# Altium project Elec391Prj.PrjPcb
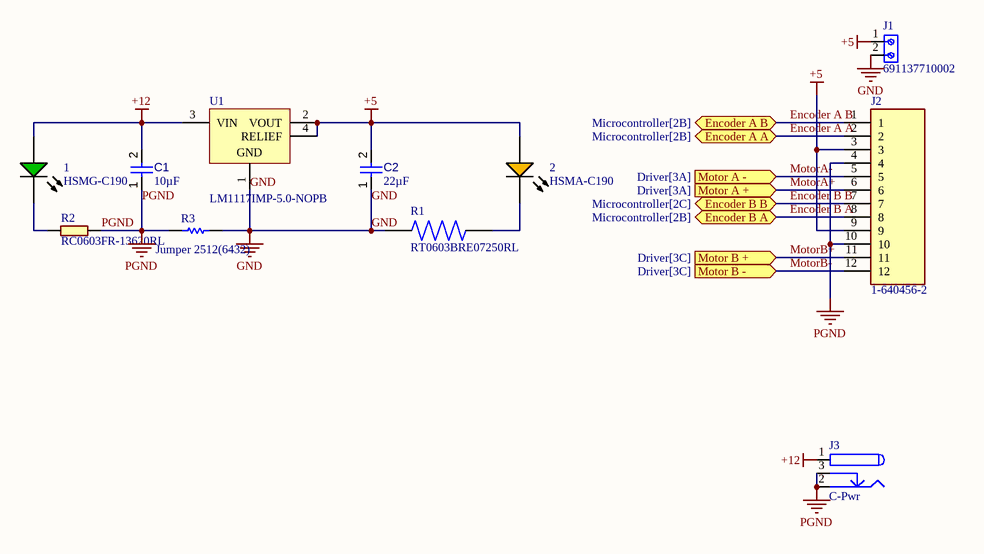
[diagram p0: IO.SchDoc]
3 sheets, 30 parts. Net scope: flat (ports and power ports of the same name join across sheets).
Board file: PCB.PcbDoc
Sheets:
  IO.SchDoc
  Microcontroller.SchDoc
  Driver.SchDoc

## Sheet IO.SchDoc
size A4; SheetNumber: 1; SheetTotal: 3

### Parts
1  HSMG-C190  [AVAG-HSMX-C190_V]
2  HSMA-C190  [AVAG-HSMX-C190_V]
C1  value 10µF  [CAPC0603(1608)100_L]  (hidden comment: Capacitor 10µF +/-20% 10V 0603)
C2  value 22µF  [CAPC0805(2012)145_L]  (hidden comment: Capacitor 22µF +/-40% 16V 0805)
J1  691137710002  [691137710002]
J2  1-640456-2  [TE_1-640456-2]
J3  C-Pwr  [KLD_XLGE1.2]
R1  RT0603BRE07250RL  [RESC1608X55N]
R2  RC0603FR-13620RL  [0603]
R3  Jumper 2512(6432)  [RESC2512(6432)_L]
U1  LM1117IMP-5.0-NOPB  [DCY0004A_M]

### Ports
Encoder A A (bidir, see Microcontroller[2B]), Encoder A B (bidir, see Microcontroller[2B]), Encoder B A (bidir, see Microcontroller[2B]), Encoder B B (bidir, see Microcontroller[2C]), Motor A + (in, see Driver[3A]), Motor A - (in, see Driver[3A]), Motor B + (in, see Driver[3C]), Motor B - (in, see Driver[3C])

### Nets
+5: 2.1(A) C2.2 J1.1 J2.3 J2.9 U1.2(VOUT) U1.4(RELIEF)
+12: 1.1(A) C1.2 J3.1 U1.3(VIN)
GND: C2.1 J1.2 R1.1 R3.2 U1.1(GND)
PGND: C1.1 J2.4 J2.10 J3.2 J3.3 R2.2 R3.1
Encoder A A: J2.2 ; port Encoder A A
Encoder A B: J2.1 ; port Encoder A B
Encoder B A: J2.8 ; port Encoder B A
Encoder B B: J2.7 ; port Encoder B B
MotorA+: J2.6 ; port Motor A +
MotorA-: J2.5 ; port Motor A -
MotorB+: J2.11 ; port Motor B +
MotorB-: J2.12 ; port Motor B -
Net1_2: 1.2(K) R2.1
Net2_2: 2.2(K) R1.2

### Library data of the parts
1 = CMP-007-00013-2: LED Uni-Color Green, 52 mW, 20 mA, -40 to 85 degC, 2-Pin SMD, RoHS, Tape and Reel; Manufacturer: Avago; Forward Current: 20mA; Viewing Angle: 170degrees; Luminous Intensity: 15mcd; Lens Style: Diffused; Forward Voltage: 2.2V; Power: 52mW; Mounting Technology: SM; RoHS Compliant: True; Packaging: TapeandReel; Illumination Colour: Green; Datasheet URL: http://docs.avagotech.com/docs/AV02-0551EN; Min Operating Temperature: -40°C; Max Operating Temperature: 85°C; Pins: 2; Package Description: 2-Pin Surface Mount Device, Body 1.6 x 0.8 mm, Height 0.9 mm; Nominal Vf: 2.2V; Case/Package: 0603; Manufacturer URL: http://www.avagotech.com/; Datasheet Version: Mar-12; Colour: Green; Package Reference: HSMX-C190; Package Quantity: 4000
2 = CMP-007-00011-2: LED Uni-Color Amber, 60 mW, 20 mA, -40 to 85 degC, 2-Pin SMD, RoHS, Tape and Reel; Manufacturer: Avago; Forward Current: 20mA; Luminous Intensity: 90mcd; Lens Style: Diffused; Power: 60mW; Nominal Vf: 1.9V; Viewing Angle: 170degrees; Illumination Colour: Orange; Datasheet Version: Sep-10; Mounting Technology: SM; Case/Package: 0603; RoHS Compliant: True; Pins: 2; Packaging: TapeandReel; Colour: Orange; Package Reference: HSMX-C190; Manufacturer URL: http://www.avagotech.com/; Package Quantity: 4000; Min Operating Temperature: -40°C; Datasheet URL: http://docs.avagotech.com/docs/AV02-0112EN; Max Operating Temperature: 85°C; Forward Voltage: 1.9V; Package Description: 2-Pin Surface Mount Device, Body 1.6 x 0.8 mm, Height 0.9 mm
C1 = CMP-001-00075-4: Chip Capacitor, 10µF +/-20%, 10V, 0603, Thickness 1 mm; Tolerance: 10%; Voltage Rating: 10V; Max Operating Temperature: 85°C; Pins: 2; Case/Package: 0603; Mounting Technology: SMT; Min Operating Temperature: -55°C
C2 = CMP-001-00081-4: Chip Capacitor, 22µF +/-40%, 16V, 0805, Thickness 1.45 mm; Tolerance: 5%; Voltage Rating: 16V; Mounting Technology: SMT; Pins: 2; Max Operating Temperature: 85°C; Case/Package: 0805; Min Operating Temperature: -55°C
J1 = 691137710002: 2 Position Wire to Board Terminal Block Horizontal with Board 0.197 (5.00mm) Through Hole; MF: WÃ¼rth Elektronik; Price: None; Check_prices: https://www.snapeda.com/parts/691137710002/W%C3%BCrth%20Elektronik/view-part/4793356/?ref=eda; MP: 691137710002; SnapEDA_Link: https://www.snapeda.com/parts/691137710002/W%C3%BCrth%20Elektronik/view-part/4793356/?ref=snap; Package: None; Availability: Warning; Value: *; Purchase-URL: https://pricing.snapeda.com/search/part/691137710002/?ref=eda
J3 = C-Pwr: Low Voltage Power Supply Connector; Published: 17-Dec-2003; DatasheetDocument: 09-May-2002; Publisher: Altium Limited; ComponentLink1Description: Manufacturer Link; ComponentLink1URL: http://domino.kycon.com/internet/Products.html; ComponentLink2URL: http://www.cui.com/product/resource/pj-102a.pdf; ComponentLink2Description: Datasheet (ELEC391)
R1 = RT0603BRE07250RL: 250 Ohms Â±0.1% 0.1W, 1/10W Chip Resistor 0603 (1608 Metric) - Thin Film; MF: Yageo; Value: *; SnapEDA_Link: https://www.snapeda.com/parts/RT0603BRE07250RL/Yageo/view-part/?ref=snap; Purchase-URL: https://pricing.snapeda.com/search/part/RT0603BRE07250RL/?ref=eda; Availability: In Stock; Price: None; Package: 1608 Yageo; Check_prices: https://www.snapeda.com/parts/RT0603BRE07250RL/Yageo/view-part/?ref=eda; MP: RT0603BRE07250RL
R2 = RC0603FR-13620RL: https://octopart.com/rc0603fr-13100kl-yageo-12819546; Package: None; Price: None; Value: *; MP: RC0603FR-13620RL; Availability: Unavailable
R3 = CMP-1018-00001-1: Jumper 2512 (6432 Metric); Tolerance: None; Case-EIA: 2512; Value: 0.00 Ohm; Case-Metric: 6432; Technology: SMT; Power: None
U1 = CMP-019-00021-4: Low-Dropout Linear Regulator, 800 mA, -40 to 125 degC, 4-Pin SOT-223 (DCY), Green (RoHS & no Sb/Br), Tape and Reel; Manufacturer: Texas Instruments; Nominal Output Voltage: 5V; Dropout Voltage: 1.2V; Output Current: 800mA; Min Input Voltage: 2.6V; Max Input Voltage: 15V; Outputs: 1; Datasheet Version: SNOS412N, 01/2016; Case/Package: SOT-223; Min Operating Temperature: -40°C; Mounting Technology: SM; Package Description: 4-Pin Small Outline Transistor, Body 6.5 x 3.5 mm, Pitch 2.3 mm; Max Ouput Current: 800mA; Output Voltage: 5V; Manufacturer URL: http://www.ti.com/; Max Operating Temperature: 125°C; Datasheet URL: http://www.ti.com/lit/ds/symlink/lm1117.pdf; Packaging: TapeandReel; RoHS Compliant: True; Package Reference: DCY0004A; Pins: 4
J2 = 1-640456-2: Package: None; Price: None; Value: *; MP: 1-640456-2; Availability: Unavailable

## Sheet Microcontroller.SchDoc
size A4; SheetNumber: 2; SheetTotal: 3
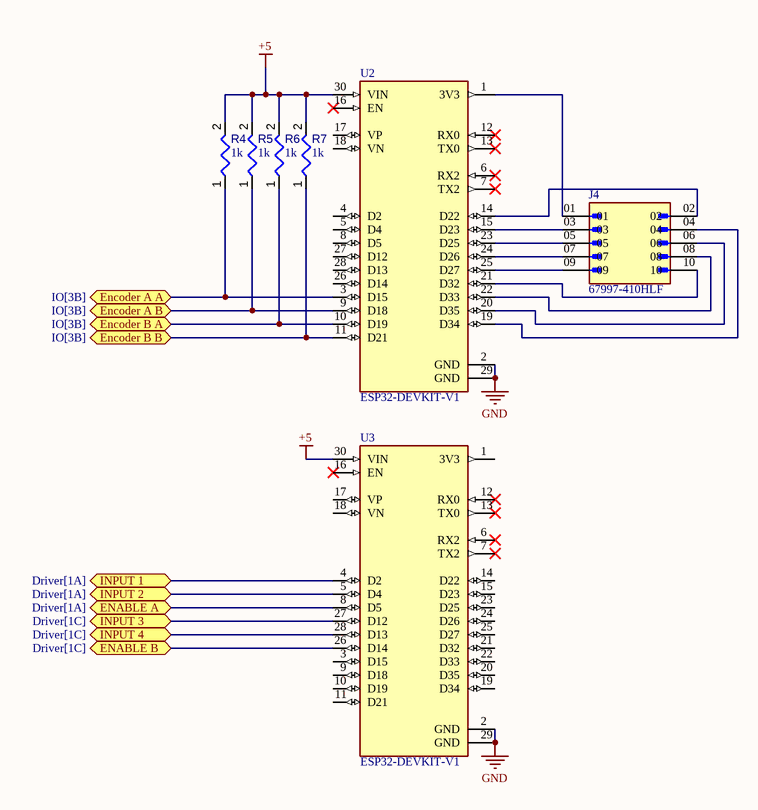
[diagram p1: Microcontroller.SchDoc]

### Parts
J4  67997-410HLF  [AMPHENOL_67997-410HLF]
R4  value 1k  [RESC1608X55X25ML10T15]  (hidden comment: Resistor 1k +/-1% 0603 100 mW)
R5  value 1k  [RESC1608X55X25ML10T15]  (hidden comment: Resistor 1k +/-1% 0603 100 mW)
R6  value 1k  [RESC1608X55X25ML10T15]  (hidden comment: Resistor 1k +/-1% 0603 100 mW)
R7  value 1k  [RESC1608X55X25ML10T15]  (hidden comment: Resistor 1k +/-1% 0603 100 mW)
U2  ESP32-DEVKIT-V1  [MODULE_ESP32_DEVKIT_V1]
U3  ESP32-DEVKIT-V1  [MODULE_ESP32_DEVKIT_V1]

### Ports
ENABLE A (bidir, see Driver[1A]), ENABLE B (bidir, see Driver[1C]), Encoder A A (bidir, see IO[3B]), Encoder A B (bidir, see IO[3B]), Encoder B A (bidir, see IO[3B]), Encoder B B (bidir, see IO[3B]), INPUT 1 (bidir, see Driver[1A]), INPUT 2 (bidir, see Driver[1A]), INPUT 3 (bidir, see Driver[1C]), INPUT 4 (bidir, see Driver[1C])

### Nets
+5: R4.2 R5.2 R6.2 R7.2 U2.30(VIN) U3.30(VIN)
GND: U2.2(GND) U2.29(GND) U3.2(GND) U3.29(GND)
Encoder A A: R4.1 U2.3(D15) ; port Encoder A A
Encoder A B: R5.1 U2.9(D18) ; port Encoder A B
Encoder B A: R6.1 U2.10(D19) ; port Encoder B A
Encoder B B: R7.1 U2.11(D21) ; port Encoder B B
NetJ4_01: J4.01 U2.1(3V3)
NetJ4_02: J4.02 U2.14(D22)
NetJ4_03: J4.03 U2.15(D23)
NetJ4_04: J4.04 U2.19(D34)
NetJ4_05: J4.05 U2.23(D25)
NetJ4_06: J4.06 U2.20(D35)
NetJ4_07: J4.07 U2.24(D26)
NetJ4_08: J4.08 U2.22(D33)
NetJ4_09: J4.09 U2.25(D27)
NetJ4_10: J4.10 U2.21(D32)
NetU3_4: U3.4(D2) ; port INPUT 1
NetU3_5: U3.5(D4) ; port INPUT 2
NetU3_8: U3.8(D5) ; port ENABLE A
NetU3_26: U3.26(D14) ; port ENABLE B
NetU3_27: U3.27(D12) ; port INPUT 3
NetU3_28: U3.28(D13) ; port INPUT 4

Not connected (* = marked no-connect by the designer): U2 4(D2) 5(D4) 6(RX2)* 7(TX2)* 8(D5) 12(RX0)* 13(TX0)* 16(EN)* 17(VP) 18(VN) 26(D14) 27(D12) 28(D13); U3 1(3V3) 3(D15) 6(RX2)* 7(TX2)* 9(D18) 10(D19) 11(D21) 12(RX0)* 13(TX0)* 14(D22) 15(D23) 16(EN)* 17(VP) 18(VN) 19(D34) 20(D35) 21(D32) 22(D33) 23(D25) 24(D26) 25(D27)

### Library data of the parts
J4 = 67997-410HLF: BergStikÂ®, Board to Board connector, Unshrouded vertical header, Through Hole, Double Row, 10 Positions, 2.54 mm (0.100in) Pitch; MF: Amphenol ICC; Value: *; MP: 67997-410HLF; Package: None; SnapEDA_Link: https://www.snapeda.com/parts/67997-410HLF/Amphenol+FCI/view-part/?ref=snap; Check_prices: https://www.snapeda.com/parts/67997-410HLF/Amphenol+FCI/view-part/?ref=eda; Digi-Key_Part_Number: 609-3243-ND; Purchase-URL: https://pricing.snapeda.com/search/part/67997-410HLF/?ref=eda
R4-R7 = CMP-009-00014-5: Chip Resistor, 1 KOhm, +/-1%, 0.1 W, -55 to 155 degC, 0603 (1608 Metric); Voltage Rating: 50V; Power: 100mW; Tolerance: 1%; Mounting Technology: SM; Pins: 2; Case/Package: 0603; Min Operating Temperature: -55°C; RoHS Compliant: True; Max Operating Temperature: 155°C
U2 U3 = ESP32-DEVKIT-V1: Dual core, Wi-Fi: 2.4 GHz up to 150 Mbits/s,BLE (Bluetooth Low Energy) and legacy Bluetooth, 32 bits, Up to 240 MHz; MF: Do it; Price: None; Availability: Not in stock; Package: None; MP: ESP32-DEVKIT-V1; Value: *; SnapEDA_Link: https://www.snapeda.com/parts/ESP32-DEVKIT-V1/Do+it/view-part/?ref=snap; Check_prices: https://www.snapeda.com/parts/ESP32-DEVKIT-V1/Do+it/view-part/?ref=eda

## Sheet Driver.SchDoc
size A4; SheetNumber: 3; SheetTotal: 3
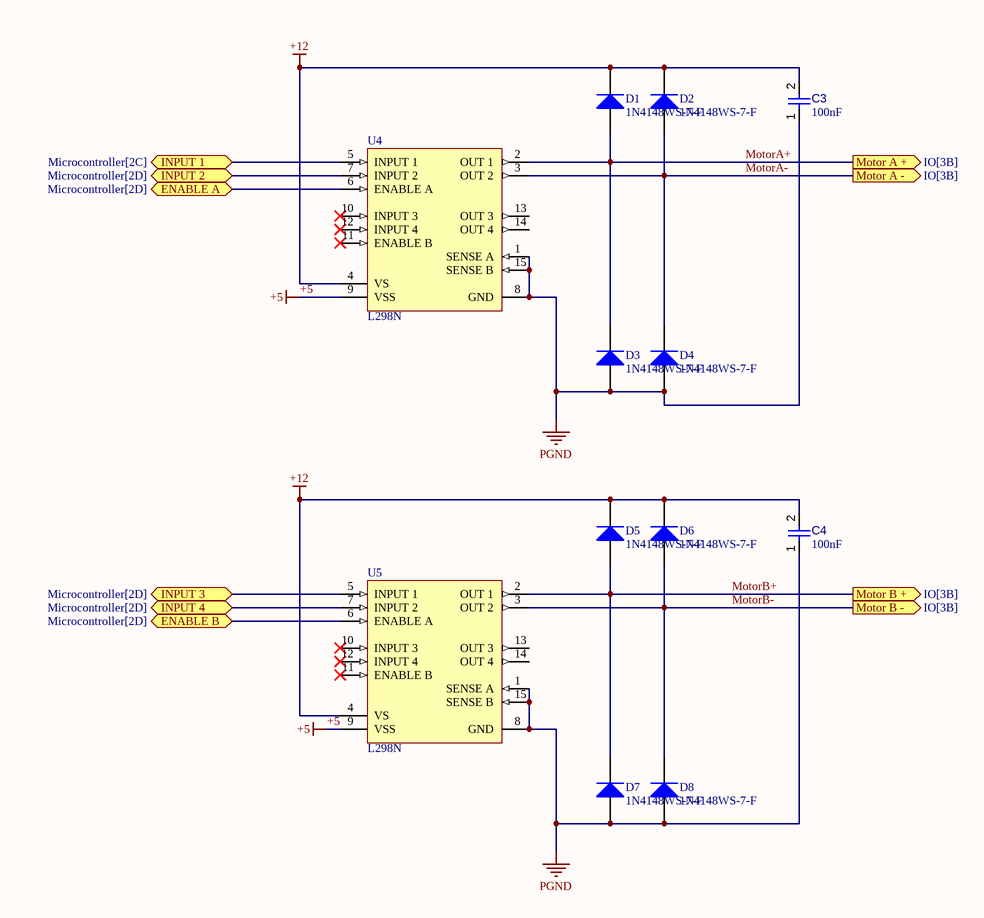
[diagram p2: Driver.SchDoc]

### Parts
C3  value 100nF  [CAPC1608X90X40NL10T20]  (hidden comment: Capacitor 100 nF +/-10% 50 V 0603)
C4  value 100nF  [CAPC1608X90X40NL10T20]  (hidden comment: Capacitor 100 nF +/-10% 50 V 0603)
D1  1N4148WS-7-F  [DIOD-SOD323-2-A_V]
D2  1N4148WS-7-F  [DIOD-SOD323-2-A_V]
D3  1N4148WS-7-F  [DIOD-SOD323-2-A_V]
D4  1N4148WS-7-F  [DIOD-SOD323-2-A_V]
D5  1N4148WS-7-F  [DIOD-SOD323-2-A_V]
D6  1N4148WS-7-F  [DIOD-SOD323-2-A_V]
D7  1N4148WS-7-F  [DIOD-SOD323-2-A_V]
D8  1N4148WS-7-F  [DIOD-SOD323-2-A_V]
U4  L298N  [STM-FM-15]
U5  L298N  [STM-FM-15]

### Ports
ENABLE A (bidir, see Microcontroller[2D]), ENABLE B (bidir, see Microcontroller[2D]), INPUT 1 (bidir, see Microcontroller[2C]), INPUT 2 (bidir, see Microcontroller[2D]), INPUT 3 (bidir, see Microcontroller[2D]), INPUT 4 (bidir, see Microcontroller[2D]), Motor A + (out, see IO[3B]), Motor A - (out, see IO[3B]), Motor B + (out, see IO[3B]), Motor B - (out, see IO[3B])

### Nets
+5: U4.9(VSS) U5.9(VSS)
+12: C3.2 C4.2 D1.2(K) D2.2(K) D5.2(K) D6.2(K) U4.4(VS) U5.4(VS)
PGND: C3.1 C4.1 D3.1(A) D4.1(A) D7.1(A) D8.1(A) U4.1(SENSE_A) U4.8(GND) U4.15(SENSE_B) U5.1(SENSE_A) U5.8(GND) U5.15(SENSE_B)
MotorA+: D1.1(A) D3.2(K) U4.2(OUT_1) ; port Motor A +
MotorA-: D2.1(A) D4.2(K) U4.3(OUT_2) ; port Motor A -
MotorB+: D5.1(A) D7.2(K) U5.2(OUT_1) ; port Motor B +
MotorB-: D6.1(A) D8.2(K) U5.3(OUT_2) ; port Motor B -
NetU3_4: U4.5(INPUT_1) ; port INPUT 1
NetU3_5: U4.7(INPUT_2) ; port INPUT 2
NetU3_8: U4.6(ENABLE_A) ; port ENABLE A
NetU3_26: U5.6(ENABLE_A) ; port ENABLE B
NetU3_27: U5.5(INPUT_1) ; port INPUT 3
NetU3_28: U5.7(INPUT_2) ; port INPUT 4

Not connected (* = marked no-connect by the designer): U4 10(INPUT_3)* 11(ENABLE_B)* 12(INPUT_4)* 13(OUT_3) 14(OUT_4); U5 10(INPUT_3)* 11(ENABLE_B)* 12(INPUT_4)* 13(OUT_3) 14(OUT_4)

### Library data of the parts
C3 C4 = CMP-001-00017-6: Chip Capacitor, 100 nF, +/- 10%, 50 V, 0603 (1608 Metric); Voltage Rating: 50V; Capacitor Type: Ceramic; Tolerance: 10%; Mounting Technology: SM; Max Operating Temperature: 125°C; RoHS Compliant: True; Pins: 2; Case/Package: 0603; Min Operating Temperature: -55°C
D1-D8 = CMP-1667-00004-1: Fast Switching Diode, 75 V, 0.3 A, -65 to 150 degC, 2-Pin SOD323, RoHS, Tape and Reel; DatasheetVersion: Rev. 25-2, 03/2016; PackageDescription: 2-Pin Small Outline Diode, Body 1.7 x 1.3 mm; ComponentLink2Description: Datasheet; ComponentLink1URL: http://www.diodes.com/; PackageReference: SOD323-2; ComponentLink2URL: http://www.diodes.com/datasheets/ds30097.pdf; ComponentLink1Description: Manufacturer URL
U4 U5 = CMP-2000-06526-1: Dual Full-Bridge Driver, 4.8 to 46 V, -40 to 150 degC, 15-Pin FM (MW 15L), RoHS, Tube; Manufacturer: STMicroelectronics; PartNumber: L298; Output Current: 2A; Supply Voltage Max: 7V; Driver Case Style: Multiwatt; Supply Voltage Min: 4.5V; No. of Pins: 15Pins; SVHC: NoSVHC(17-Dec-2015); Output Voltage: 46V; No. of Outputs: 4Outputs; Motor Type: FullBridge; MSL: -; Package Description: 15-Pin Flange Mount, Body 5 x 19.6 mm, Pitch 1.27 mm; Datasheet Version: 01/2000; Package Reference: FM-15; Mounting Technology: ThroughHole; Packaging: Each; Automotive Qualification Standard: -; Product Range: -; Datasheet URL: https://datasheet.ciiva.com/15109/getdatasheetpartid-50682-15109332.pdf; Operating Temperature Max: 130°C; Operating Temperature Min: -25°C; Manufacturer URL: http://www.st.com/

## Nets that join several sheets
+5: IO (7 pins), Microcontroller (6 pins), Driver (U4.9 U5.9)
+12: IO (1.1 C1.2 J3.1 U1.3), Driver (8 pins)
GND: IO (5 pins), Microcontroller (U2.2 U2.29 U3.2 U3.29)
PGND: IO (7 pins), Driver (12 pins)
Encoder A A: IO (J2.2), Microcontroller (R4.1 U2.3)
Encoder A B: IO (J2.1), Microcontroller (R5.1 U2.9)
Encoder B A: IO (J2.8), Microcontroller (R6.1 U2.10)
Encoder B B: IO (J2.7), Microcontroller (R7.1 U2.11)
MotorA+: IO (J2.6), Driver (D1.1 D3.2 U4.2)
MotorA-: IO (J2.5), Driver (D2.1 D4.2 U4.3)
MotorB+: IO (J2.11), Driver (D5.1 D7.2 U5.2)
MotorB-: IO (J2.12), Driver (D6.1 D8.2 U5.3)
NetU3_4: Microcontroller (U3.4), Driver (U4.5)
NetU3_5: Microcontroller (U3.5), Driver (U4.7)
NetU3_8: Microcontroller (U3.8), Driver (U4.6)
NetU3_26: Microcontroller (U3.26), Driver (U5.6)
NetU3_27: Microcontroller (U3.27), Driver (U5.5)
NetU3_28: Microcontroller (U3.28), Driver (U5.7)